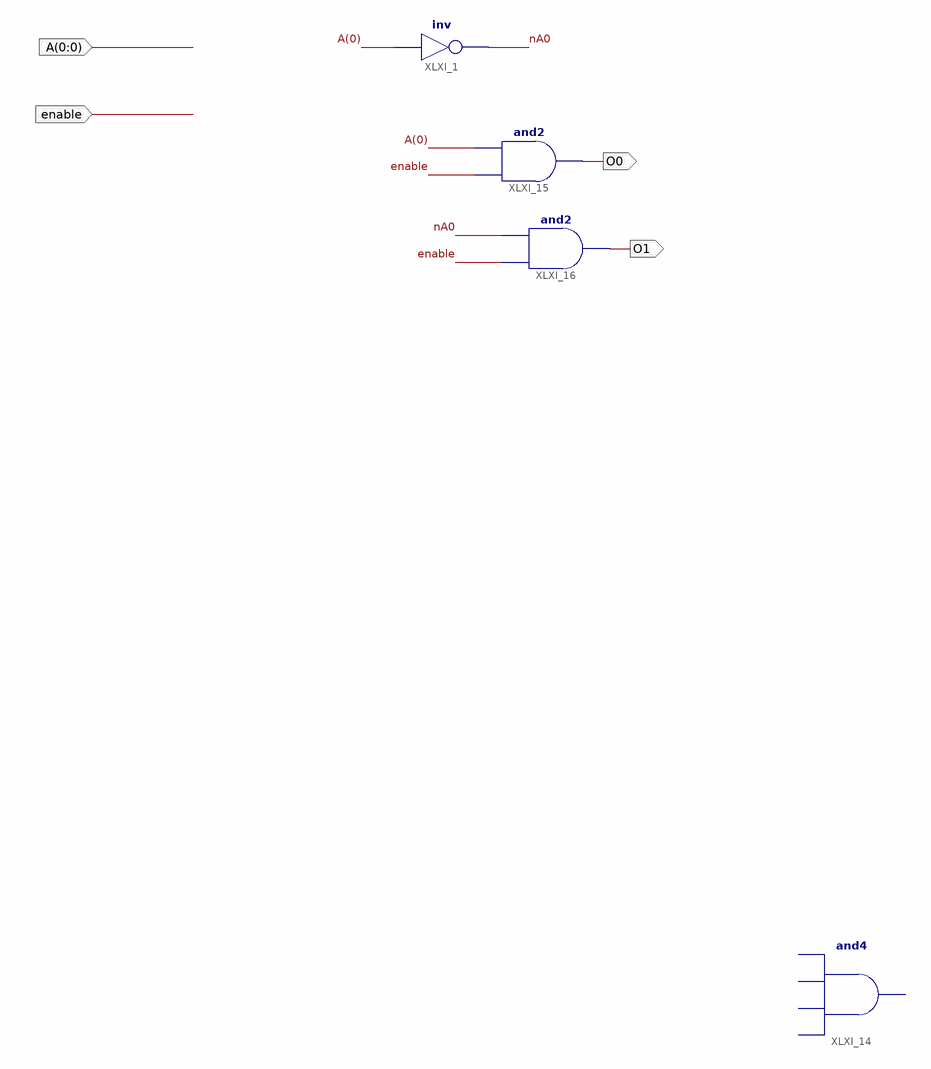
[diagram p0: schematic sheet 1]
// Xilinx ISE schematic decode3b8.sch (spartan3e) as structural Verilog: 4 symbols, 4 ports
module decode3b8 (
  input  [0:0] A,
  input  enable,
  output O0,
  output O1
);

  wire nA0;

  not XLXI_1 (nA0, A[0]);
  // and4 XLXI_14 is placed but not wired
  and XLXI_15 (O0, enable, A[0]);
  and XLXI_16 (O1, enable, nA0);
endmodule
